# EAGLE design AudioBoard4 (EAGLE 6.6.0)

## Sheet 1 of 2
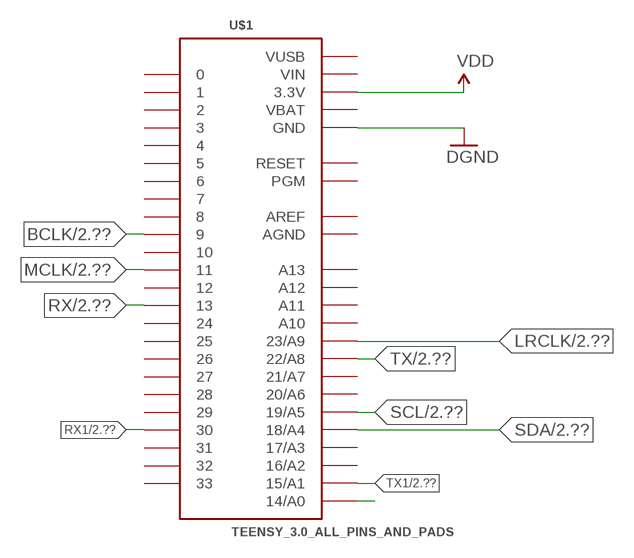
[diagram p0: schematic, sheet 1]

### Parts
U$1  TEENSY_3.0_ALL_PINS_AND_PADS  [TEENSY_3.0_ALLPINS]

### Nets
BCLK: U$1.9 ; also sheet 2
GND: U$1.GND U$1.GND1(GND) U$1.GND2(GND) ; supply symbol labelled DGND ; also sheet 2
LRCLK: U$1.23/A9 ; also sheet 2
MCLK: U$1.11 ; also sheet 2
PDN: U$1.14/A0 ; also sheet 2
RX: U$1.13 ; also sheet 2
RX1: U$1.30 ; also sheet 2
SCL: U$1.19/A5 ; also sheet 2
SDA: U$1.18/A4 ; also sheet 2
TX: U$1.22/A8 ; also sheet 2
TX1: U$1.15/A1 ; also sheet 2
VDD: U$1.3.3V U$1.3.3V1(3.3V) U$1.3.3V2(3.3V) ; also sheet 2
Unconnected: U$1.0 U$1.1 U$1.2 U$1.3 U$1.4 U$1.5 U$1.6 U$1.7 U$1.8 U$1.10 U$1.12 U$1.16/A2 U$1.17/A3 U$1.20/A6 U$1.21/A7 U$1.24 U$1.25 U$1.26 U$1.27 U$1.28 U$1.29 U$1.31 U$1.32 U$1.33 U$1.A10 U$1.A11 U$1.A12 U$1.A13 U$1.PGM U$1.RESET

## Sheet 2 of 2
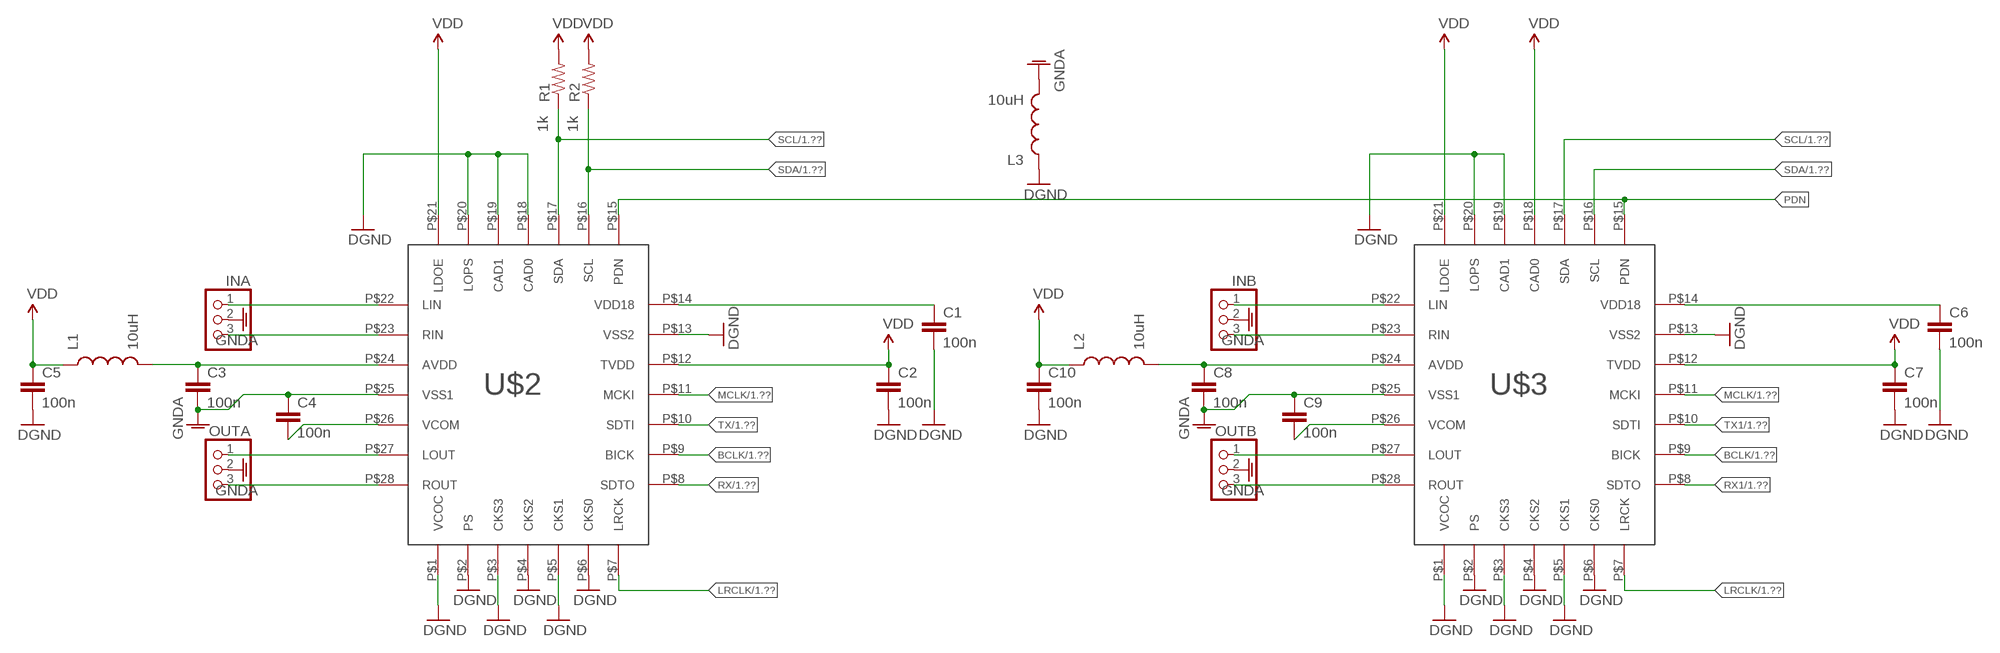
[diagram p1: schematic, sheet 2]

### Parts
C1  100n  CAP0603-CAP  [0603-CAP]
C2  100n  CAP0603-CAP  [0603-CAP]
C3  100n  CAP0603-CAP  [0603-CAP]
C4  100n  CAP0603-CAP  [0603-CAP]
C5  100n  CAP0603-CAP  [0603-CAP]
C6  100n  CAP0603-CAP  [0603-CAP]
C7  100n  CAP0603-CAP  [0603-CAP]
C8  100n  CAP0603-CAP  [0603-CAP]
C9  100n  CAP0603-CAP  [0603-CAP]
C10  100n  CAP0603-CAP  [0603-CAP]
INA  PINHD-1X3  [1X03]
INB  PINHD-1X3  [1X03]
L1  10uH  INDUCTOR0805  [0805]
L2  10uH  INDUCTOR0805  [0805]
L3  10uH  INDUCTOR0603  [0603]
OUTA  PINHD-1X3  [1X03]
OUTB  PINHD-1X3  [1X03]
R1  1k  RESISTOR0603-RES  [0603-RES]
R2  1k  RESISTOR0603-RES  [0603-RES]
U$2  AK4558EN  [QFN-28-5MM]
U$3  AK4558EN  [QFN-28-5MM]

### Nets
BCLK: U$2.P$9(BICK) U$3.P$9(BICK) ; also sheet 1
GND: C1.2 C2.2 C5.2 C6.2 C7.2 C10.2 L3.1 U$2.P$1(VCOC) U$2.P$2(PS) U$2.P$3(CKS3) U$2.P$4(CKS2) U$2.P$5(CKS1) U$2.P$6(CKS0) U$2.P$13(VSS2) U$2.P$18(CAD0) U$2.P$19(CAD1) U$2.P$20(LOPS) U$3.P$1(VCOC) U$3.P$2(PS) U$3.P$3(CKS3) U$3.P$4(CKS2) U$3.P$5(CKS1) U$3.P$6(CKS0) U$3.P$13(VSS2) U$3.P$19(CAD1) U$3.P$20(LOPS) ; supply symbol labelled DGND ; also sheet 1
GNDA: C3.2 C4.1 C8.2 C9.1 INA.2 INB.2 L3.2 OUTA.2 OUTB.2 U$2.P$25(VSS1) U$3.P$25(VSS1)
LRCLK: U$2.P$7(LRCK) U$3.P$7(LRCK) ; also sheet 1
MCLK: U$2.P$11(MCKI) U$3.P$11(MCKI) ; also sheet 1
N$1: C1.1 U$2.P$14(VDD18)
N$2: C3.1 L1.2 U$2.P$24(AVDD)
N$4: C4.2 U$2.P$26(VCOM)
N$6: INA.1 U$2.P$22(LIN)
N$7: INA.3 U$2.P$23(RIN)
N$8: OUTA.1 U$2.P$27(LOUT)
N$9: OUTA.3 U$2.P$28(ROUT)
N$10: C6.1 U$3.P$14(VDD18)
N$11: C8.1 L2.2 U$3.P$24(AVDD)
N$12: C9.2 U$3.P$26(VCOM)
N$13: INB.1 U$3.P$22(LIN)
N$14: INB.3 U$3.P$23(RIN)
N$15: OUTB.1 U$3.P$27(LOUT)
N$16: OUTB.3 U$3.P$28(ROUT)
PDN: U$2.P$15(PDN) U$3.P$15(PDN) ; also sheet 1
RX: U$2.P$8(SDTO) ; also sheet 1
RX1: U$3.P$8(SDTO) ; also sheet 1
SCL: R1.1 U$2.P$17(SDA) U$3.P$17(SDA) ; also sheet 1
SDA: R2.1 U$2.P$16(SCL) U$3.P$16(SCL) ; also sheet 1
TX: U$2.P$10(SDTI) ; also sheet 1
TX1: U$3.P$10(SDTI) ; also sheet 1
VDD: C2.1 C5.1 C7.1 C10.1 L1.1 L2.1 R1.2 R2.2 U$2.P$12(TVDD) U$2.P$21(LDOE) U$3.P$12(TVDD) U$3.P$18(CAD0) U$3.P$21(LDOE) ; also sheet 1

## Power pins joined to a net without a drawn wire
AGND: U$1.AGND
AREF: U$1.AREF
VBAT: U$1.VBAT
VIN: U$1.VIN
VUSB: U$1.VUSB

## Library data of the parts
C1-C10 = SparkFun-Passives:CAP: Capacitor Standard 0603 ceramic capacitor, and 0.1" leaded capacitor.
INA INB OUTA OUTB = adafruit:PINHD-1X3: PIN HEADER
L1-L3 = SparkFun-Passives:INDUCTOR: Inductors Basic Inductor/Choke - 0603 and 1206. Footprints are not proven and vary greatly between part numbers. INDUCTOR POWER 3.3UH 4.0A SMD 0.197" L x 0.197" W x 0.177" H (5.00mm x 5.00mm x 4.50mm)
R1 R2 = SparkFun-Passives:RESISTOR: Resistor Basic schematic elements and footprints for 0603, 1206, and PTH resistors.
U$1 = Teensy_3_Series_Board_v1.0:TEENSY_3.0_ALL_PINS_AND_PADS: Teensy 3.0 with all pin holes and optional SMD-mount unshrouded header on bottom of Teensy 3.0. For more basic versions, see 'Basic', '+4' and 'AllAnalogPins'. Requires the installation of a un-shrouded SMD header on the underside of the Teensy 3.0
U$2 U$3 = AK4558:AK4558EN

## Board
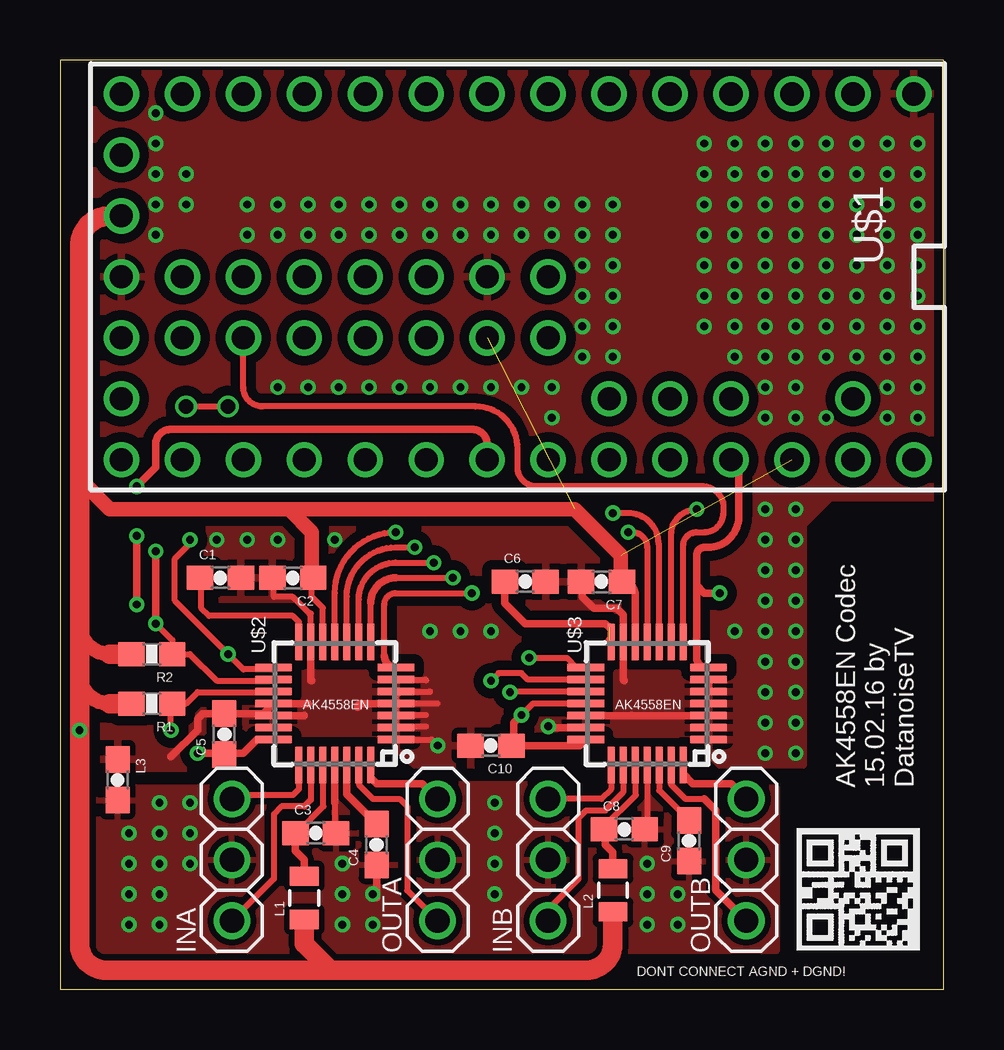
[diagram p2: board, top side]
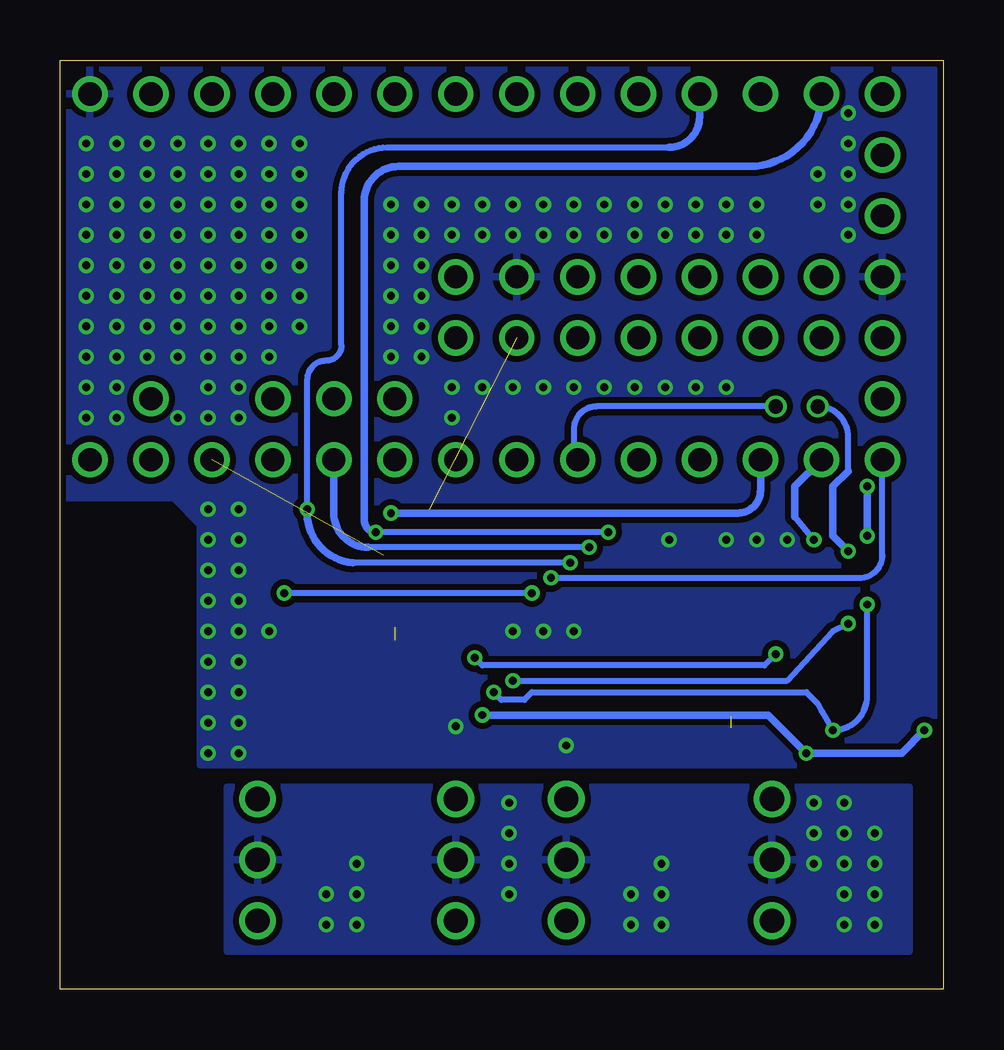
[diagram p3: board, bottom side, seen from below]

Size 36.81 x 38.72 mm. Coordinates in mm from the lower left corner, seen from the top.
Outline: 0,0 36.81,0 36.81,38.72 0,38.72 0,0
Copper layers (1*16): Top 0.035mm / dielectric 1.5mm / Bottom 0.035mm
Design rules "SeeedStudio_2layer_DRU_no_angle_20140221 *": minimum track width 6mil, minimum drill 12mil, track to track 6mil, track to pad 6mil, pad to pad 6mil, via to via 6mil, smd to smd 0mil, copper to edge 10mil, drill to drill 10mil, minimum pad ring 10mil, minimum via ring 6mil, stop-mask expansion 2mil, vias tented up to drill 13mil, thermal gap 10mil

### Footprints (pad centres in the part's own frame; a part is rotated, then mirrored left to right if it is on the bottom)
0603-CAP = smd 1.1 x 1: 1 -0.85,0; 2 0.85,0
1X03 = drill 1.016: 1 -2.54,0; 2 0,0; 3 2.54,0
0805 = smd 0.8 x 1.2: 1 -0.9,0; 2 0.9,0
0603 = smd 1.1 x 1: 1 -0.85,0; 2 0.85,0
0603-RES = smd 1.1 x 1: 1 -0.85,0; 2 0.85,0
TEENSY_3.0_ALLPINS = drill 0.965: 0 -7.62,13.97; 1 -7.62,11.43; 2 -7.62,8.89; 3 -7.62,6.35; 3.3V 7.62,11.43; 3.3V1 -2.54,-16.51; 3.3V2 2.54,-1.27; 4 -7.62,3.81; 5 -7.62,1.27; 6 -7.62,-1.27; 7 -7.62,-3.81; 8 -7.62,-6.35; 9 -7.62,-8.89; 10 -7.62,-11.43; 11 -7.62,-13.97; 12 -7.62,-16.51; 13 7.62,-16.51; 14/A0 7.62,-13.97; 15/A1 7.62,-11.43; 16/A2 7.62,-8.89; 17/A3 7.62,-6.35; 18/A4 7.62,-3.81; 19/A5 7.62,-1.27; 20/A6 7.62,1.27; 21/A7 7.62,3.81; 22/A8 7.62,6.35; 23/A9 7.62,8.89; 24 0,-3.81; 25 0,-6.35; 26 0,-8.89; 27 0,-11.43; 28 0,-13.97; 29 2.54,-13.97; 30 2.54,-11.43; 31 2.54,-8.89; 32 2.54,-6.35; 33 2.54,-3.81; A10 5.08,6.35; A11 5.08,3.81; A12 0,1.27; A13 2.54,1.27; AGND 7.62,13.97; AREF 5.08,8.89; GND -7.62,16.51; GND1 0,-16.51; GND2 0,-1.27; PGM 2.54,-16.51; RESET 5.08,-16.51; VBAT -5.08,-16.51; VIN 7.62,16.51; VUSB 5.08,13.97
QFN-28-5MM = smd 1.524 x 0.3: P$1 -2.559,1.5; P$2 -2.559,1; P$3 -2.559,0.5; P$4 -2.559,0; P$5 -2.559,-0.5; P$6 -2.559,-1; P$7 -2.559,-1.5; P$15 2.559,-1.5; P$16 2.559,-1; P$17 2.559,-0.5; P$18 2.559,0; P$19 2.559,0.5; P$20 2.559,1; P$21 2.559,1.5 | smd 0.3 x 1.524: P$8 -1.5,-2.559; P$9 -1,-2.559; P$10 -0.5,-2.559; P$11 0,-2.559; P$12 0.5,-2.559; P$13 1,-2.559; P$14 1.5,-2.559; P$22 1.5,2.559; P$23 1,2.559; P$24 0.5,2.559; P$25 0,2.559; P$26 -0.5,2.559; P$27 -1,2.559; P$28 -1.5,2.559

### Placement (x,y rotation side)
C1  6.67,17.14 0 top
C2  9.68,17.14 180 top
C3  10.64,6.51 0 top
C4  13.18,6.03 90 top
C5  6.83,10.64 90 top
C6  19.37,16.99 0 top
C7  22.54,16.99 180 top
C8  23.49,6.67 0 top
C9  26.19,6.19 90 top
C10  17.94,10.16 180 top
INA  7.14,5.4 270 top
INB  20.32,5.4 270 top
L1  10.16,3.81 90 top
L2  23.02,4.13 90 top
L3  2.38,8.73 270 top
OUTA  15.72,5.4 90 top
OUTB  28.57,5.4 90 top
R1  3.81,11.91 180 top
R2  3.81,13.97 180 top
U$1  19.05,29.69 270 top
U$2  11.43,11.91 180 top
U$3  24.45,11.91 180 top

### Tracks (layer width: path | path; a pad name or v marks a point on that pad's centre or on a via)
BCLK  (via drill 0.33)
  Top 0.254: U$3.P$9 25.45,18.94 arc-90 v26.51,20 | U$2.P$9 12.43,16.24 arc-90 13.97,17.78 v15.56,17.78
  Bottom 0.254: v15.56,17.78 24.61,17.78 | v26.51,20 26.51,25.4 arc90 25.72,26.19 arc-90 25.08,26.83 25.08,33.18 arc90 23.18,35.08 11.43,35.08
  Bottom 0.305: 24.61,17.78 arc90 v26.51,20 | U$1.9 10.16,36.35 arc90 11.43,35.08
GND  (via drill 0.33)  (1 unrouted)
  Top 0.254: U$2.P$13 10.43,15.67 10.37,15.67 9.68,16.35 8.89,16.35 8.89,17.09 C2.2 | U$2.P$1 15.47,10.41 v15.72,10.16 | U$2.P$6 15.19,12.91 arc-90 15.24,12.86 | U$2.P$5 15.38,12.41 arc-90 15.4,12.38 14.13,12.38 13.97,12.22 13.97,11.91 14.13,11.91 | 15.72,11.91 14.13,11.91 | 14.13,11.91 13.97,11.75 13.97,11.43 | 15.24,11.43 13.97,11.43 | 13.97,11.43 13.97,10.95 15.24,10.95
  Top 0.305: 10.32,11.91 U$2.P$18 8.45,11.49 C5.2 5.93,11.49 5.71,11.27 5.71,10.8 4.6,9.68 | C7.2 21.75,16.93 21.75,16.35 22.22,15.87 23.18,15.87 23.45,15.6 U$3.P$13 23.45,12.91 23.49,12.86 | U$2.P$13 10.43,12.91 arc90 10.48,12.86 | U$2.P$4 13.97,11.91 12.54,11.91 arc90 12.38,11.75 | U$2.P$19 10.14,11.41 arc90 10.16,11.43 | U$3.P$19 23.79,11.41 23.81,11.43 23.84,11.41 U$3.P$3 | U$3.P$20 20.53,10.91 20.48,10.95 | U$3.P$6 U$3.P$5
  other vias: 20.32,10.95 9.05,18.73 11.43,18.73 7.78,18.73 6.51,18.73 15.4,14.92 16.67,14.92 17.94,14.92 29.37,13.65 29.37,12.38 29.37,11.11 29.37,9.84 29.37,14.92 29.37,16.19 29.37,17.46 29.37,18.73 29.37,20 30.64,13.65 30.64,12.38 30.64,11.11 30.64,9.84 30.64,14.92 30.64,16.19 30.64,17.46 30.64,18.73 30.64,20 28.1,14.92 5.24,32.7 7.78,32.7 9.05,32.7 10.32,32.7 11.59,32.7 12.86,32.7 14.13,32.7 15.4,32.7 16.67,32.7 17.94,32.7 19.21,32.7 20.48,32.7 21.75,32.7 23.02,32.7 23.02,31.43 23.02,28.89 23.02,30.16 23.02,27.62 23.02,26.35 21.75,26.35 21.75,27.62 21.75,28.89 21.75,30.16 21.75,31.43 20.48,31.43 19.21,31.43 17.94,31.43 16.67,31.43 15.4,31.43 14.13,31.43 12.86,31.43 11.59,31.43 10.32,31.43 9.05,31.43 7.78,31.43 9.05,25.08 10.32,25.08 11.59,25.08 12.86,25.08 14.13,25.08 15.4,25.08 16.67,25.08 17.94,25.08 19.21,25.08 20.48,25.08 20.48,23.81 3.97,32.7 3.97,31.43 3.97,33.97 3.97,35.24 5.24,33.97 3.97,36.51 26.83,32.7 26.83,31.43 26.83,30.16 26.83,28.89 26.83,27.62 28.1,26.35 28.1,27.62 28.1,28.89 28.1,30.16 28.1,31.43 28.1,32.7 29.37,32.7 29.37,31.43 29.37,30.16 29.37,28.89 29.37,27.62 29.37,26.35 29.37,25.08 29.37,23.81 30.64,23.81 31.91,23.81 30.64,25.08 30.64,26.35 31.91,26.35 31.91,27.62 30.64,27.62 30.64,28.89 30.64,30.16 30.64,31.43 30.64,32.7 31.91,32.7 31.91,31.43 31.91,30.16 31.91,28.89 33.18,26.35 33.18,28.89 33.18,27.62 34.45,26.35 35.72,26.35 35.72,25.08 34.45,25.08 34.45,23.81 35.72,23.81 34.45,27.62 35.72,27.62 35.72,28.89 34.45,28.89 33.18,30.16 34.45,30.16 35.72,30.16 35.72,31.43 34.45,31.43 33.18,31.43 33.18,32.7 34.45,32.7 35.72,32.7 26.83,33.97 28.1,33.97 29.37,33.97 30.64,33.97 31.91,33.97 33.18,33.97 34.45,33.97 35.72,33.97 35.72,35.24 34.45,35.24 33.18,35.24 31.91,35.24 30.64,35.24 29.37,35.24 28.1,35.24 26.83,35.24
  pour Top (isolate 0.254): 10.32,13.18 10.32,10.79 12.7,10.79 12.7,13.18
  pour Top (isolate 0.406): 1.43,9.21 8.1,9.21 9.21,10.32 13.65,10.32 14.76,9.37 21.91,9.37 23.02,10.48 26.35,10.48 27.46,9.37 30.96,9.37 30.96,19.37 32.07,20.48 37.15,20.48 37.15,38.26 31.11,38.42 1.43,38.42
  pour Top (isolate 0.254): 23.18,13.18 23.18,10.64 25.72,10.64 25.72,13.18
  pour Bottom (isolate 0.254): 0,9.37 30.96,9.37 30.96,19.37 32.07,20.48 37.15,20.48 37.31,38.1 36.51,38.89 0.95,38.89 0,37.94
GNDA  (via drill 0.33)
  Top 0.254: U$3.P$25 24.45,6.77 | 11.43,7.78 11.43,6.56 C3.2
  Top 0.305: U$2.P$25 11.43,7.78 | C4.1 13.18,3.81 | 24.45,6.77 C8.2
  other vias: 4.13,7.78 5.4,7.78 5.4,6.51 4.13,6.51 2.86,6.51 2.86,5.24 4.13,5.24 5.4,5.24 4.13,3.97 2.86,3.97 2.86,2.7 4.13,2.7 11.75,2.7 11.75,3.97 11.75,5.24 13.02,2.7 13.02,3.97 18.1,3.97 18.1,5.24 18.1,6.51 18.1,7.78 24.45,3.97 24.45,5.24 25.72,3.97 25.72,2.7 24.45,2.7
  pour Top (isolate 0.254): 9.84,8.57 22.54,8.57 22.54,8.73 26.35,8.73 26.35,8.41 29.84,8.41 29.84,1.59 1.43,1.59 1.43,8.41 9.84,8.41
  pour Bottom (isolate 0.254): 1.43,8.41 1.43,1.59 29.84,1.59 29.84,8.41
LRCLK  (via drill 0.33)
  Top 0.254: 13.49,16.03 arc-90 13.97,16.51 | 13.49,13.9 13.49,16.03 | 13.49,16.03 arc-90 13.97,16.51 | 13.97,16.51 v17.14,16.51
  Top 0.305: U$3.P$7 26.92,13.41 arc-90 26.51,13.81 26.51,16.83 | 26.51,16.83 26.51,18.1 arc-90 26.83,18.42 26.99,18.42 arc90 28.26,19.69 28.26,21.75 arc90 U$1.23/A9 | v27.46,16.51 26.83,16.51 26.51,16.83 | U$2.P$7 arc-90 13.49,13.9 arc90 U$2.P$7
  Bottom 0.254: v17.14,16.51 v27.46,16.51
MCLK  (via drill 0.33)
  Top 0.254: U$2.P$11 11.43,16.51 arc-90 v13.97,19.05 | 23.81,19.05 arc-90 24.45,18.42 U$3.P$11
  Top 0.305: v23.65,19.05 23.81,19.05
  Bottom 0.254: v13.97,19.05 v23.65,19.05
  Bottom 0.305: U$1.11 arc90 8.1,34.29 22.7,34.29 arc-90 24.13,32.86 24.13,19.53 arc-90 v23.65,19.05
N$1
  Top 0.254: U$2.P$14 9.93,15.31 9.68,15.56 6.19,15.56 5.87,15.87 5.87,17.04
  Top 0.305: 5.87,17.04 C1.1
N$2
  Top 0.254: 9.84,6.56 9.9,6.56 10.95,7.62 10.95,9.32 U$2.P$24
  Top 0.305: 9.84,6.56 C3.1 9.79,5.77 10.16,5.4 L1.2
N$4
  Top 0.305: U$2.P$26 11.93,8.13 C4.2
N$6
  Top 0.254: 9.93,8.66 9.93,8.34 9.68,8.1 7.3,8.1 INA.1
  Top 0.305: U$2.P$22 9.93,8.66
N$7
  Top 0.254: INA.3 8.89,4.6 8.89,7.3 9.21,7.62 10.16,7.62 10.43,7.89 U$2.P$23
N$8
  Top 0.254: U$2.P$27 12.43,8.53 13.02,7.94 14.13,7.94 14.45,7.62 14.45,4.13 OUTA.1
N$9
  Top 0.305: U$2.P$28 12.93,8.82 13.18,8.57 15.08,8.57 OUTA.3
N$10  (1 unrouted)
  Top 0.305: C6.1 18.52,16.09 19.37,15.24 22.7,15.24 22.86,15.08 | 22.86,14.55 U$3.P$14
N$11
  Top 0.254: 22.64,6.77 23.97,8.1 23.97,9.32
  Top 0.305: 22.64,6.77 C8.1 22.7,6.61 22.7,6.03 23.02,5.71 L2.2 | 23.97,9.32 U$3.P$24
N$12
  Top 0.254: U$3.P$26 24.95,8.29 C9.2
N$13
  Top 0.254: 20.32,7.62 INB.1 22.54,7.94 22.95,8.34 U$3.P$22
N$14
  Top 0.254: INB.3 20.32,3.33 21.59,4.6 21.59,7.14 21.91,7.46 22.7,7.46 23.45,8.21 U$3.P$23
N$15
  Top 0.254: U$3.P$27 25.45,8.53 26.03,7.94 26.83,7.94
  Top 0.305: 26.83,7.94 27.3,7.46 27.3,4.13 OUTB.1
N$16
  Top 0.305: U$3.P$28 25.95,8.98 26.35,8.57 27.94,8.57 OUTB.3
PDN  (via drill 0.33)
  Top 0.254: U$2.P$15 8.8,13.33 7.62,13.33 v6.98,13.97 4.76,16.19 4.76,17.94 5.4,18.57 v5.4,18.73 | v19.53,13.81 21.11,13.81 21.52,13.41 U$3.P$15
  Bottom 0.254: v6.98,13.97 7.46,13.49 19.21,13.49 v19.53,13.81 | v5.4,18.73 6.19,19.69
  Bottom 0.305: 6.19,19.69 6.19,20.96 U$1.14/A0
RX  (via drill 0.33)
  Top 0.254: U$2.P$8 12.93,16.1 | 12.93,16.1 arc-90 13.97,17.14 | 12.93,16.1 arc-90 13.97,17.14 | 13.97,17.14 v16.35,17.14
  Top 0.305: 12.93,16.1 arc-90 13.97,17.14 arc90 12.93,16.1
  Bottom 0.254: v16.35,17.14 3.49,17.14 arc-90 2.54,18.1 U$1.13
RX1
  Top 0.254: U$3.P$8 25.95,18.49 arc-90 26.51,19.05 26.83,19.05 arc90 27.62,19.84 27.62,20 arc90 26.83,20.96 19.84,20.96 arc-90 19.05,21.75 19.05,22.54 arc90 17.3,24.29 8.41,24.29 arc-90 7.62,25.08 U$1.30
SCL  (via drill 0.33)
  Top 0.254: U$2.P$17 8.85,12.38 5.71,12.38 5.24,11.91 R1.1 4.6,11.85 v4.6,10.8 | U$3.P$17 18.76,12.41 v18.73,12.38
  Top 0.305: U$1.19/A5 17.78,22.7 arc90 17.14,23.34 4.6,23.34 arc90 3.97,22.7 3.97,21.75 v3.17,20.96 | v3.17,18.89 v3.17,16.03
  Bottom 0.254: 18.57,12.22 v18.73,12.38 18.41,12.06 17.46,12.06 17.14,12.38 5.71,12.38 5.24,11.91 5.08,11.59 v4.6,10.8 arc-90 3.17,12.22 v3.17,16.03
  Bottom 0.305: v3.17,20.96 v3.17,18.89
SDA  (via drill 0.33, 0.6)
  Top 0.254: R2.1 5.4,13.97 6.51,12.86 8.82,12.86 U$2.P$16 | v17.94,12.86 18.26,13.18 19.21,13.18 19.48,12.91 U$3.P$16 | 4.6,14.03 R2.1 | v3.97,15.24 4.66,14.55 R2.1 | v5.24,24.29 v6.98,24.29
  Top 0.305: v3.97,18.26 v3.97,15.24
  Bottom 0.254: v17.94,12.86 6.51,12.86 4.6,14.92 v3.97,15.24 | 3.97,21.59 3.97,23.02 arc-90 v5.24,24.29 | v6.98,24.29 14.45,24.29 arc-90 15.4,23.34 15.4,22.22 arc-90 U$1.18/A4
  Bottom 0.305: 3.97,21.59 4.6,20.96 4.6,18.89 v3.97,18.26
TX  (via drill 0.33)
  Top 0.254: U$2.P$10 11.93,16.37 arc-90 13.97,18.42 v14.76,18.42
  Bottom 0.254: v14.76,18.42 23.97,18.42
  Bottom 0.305: 23.97,18.42 arc90 25.4,19.84 U$1.22/A8
TX1  (via drill 0.33)
  Top 0.254: U$3.P$10 24.95,18.55 arc-90 24.92,18.57 arc90 23.65,19.84 v23.02,19.84
  Bottom 0.305: v23.02,19.84 8.57,19.84 arc-90 7.62,20.8 U$1.15/A1
VDD  (via drill 0.33)  (2 unrouted)
  Top 0.254: 10.48,17.09 10.48,16.35 10.93,15.9 U$2.P$12 | U$3.P$18 19.68,11.91 v19.21,11.43
  Top 0.305: C2.1 10.48,17.09 10.48,17.3 | U$3.P$12 23.95,16.43 | 23.95,16.43 arc90 C7.1 | U$2.P$21 8.18,10.41 7.62,9.84 6.88,9.84 C5.1 | 23.95,16.43 23.95,16.53 23.65,16.83 23.49,16.83 23.34,16.99 | 6.72,9.84 v5.71,9.84 | U$3.P$21 21.64,10.16 C10.1 18.89,10.22 18.89,11.11 v19.21,11.43
  Top 0.61: 6.72,9.84 C5.1 | 2.06,13.97 arc-90 0.79,15.24 | 2.06,11.91 arc-90 0.79,13.18 | 10.48,17.3 10.48,19.05 9.52,20 | 9.52,20 2.06,20 0.79,21.27 | 23.34,16.99 23.34,18.1 21.43,20 9.52,20
  Top 0.813: R1.2 2.06,11.91 | R2.2 2.06,13.97 | L1.1 10.16,1.9 11.27,0.79 | L2.1 23.02,1.9 arc-90 21.91,0.79 11.27,0.79 | 11.27,0.79 1.91,0.79 arc-90 0.79,1.9 v0.79,10.8 0.79,13.18 0.79,15.24 0.79,21.27 0.79,30.96 arc-90 2.06,32.23 U$1.3.3V1
  Bottom 0.305: v0.79,10.8 1.75,9.84 v5.71,9.84 7.3,11.43 v19.21,11.43

### Text on the board
tPlace: AK4558EN Codec / 15.02.16 by / DatanoiseTV | DONT CONNECT AGND + DGND!